# Altium schematic sheet Xbee.SchDoc
size A; SheetNumber: 3; SheetTotal: 3
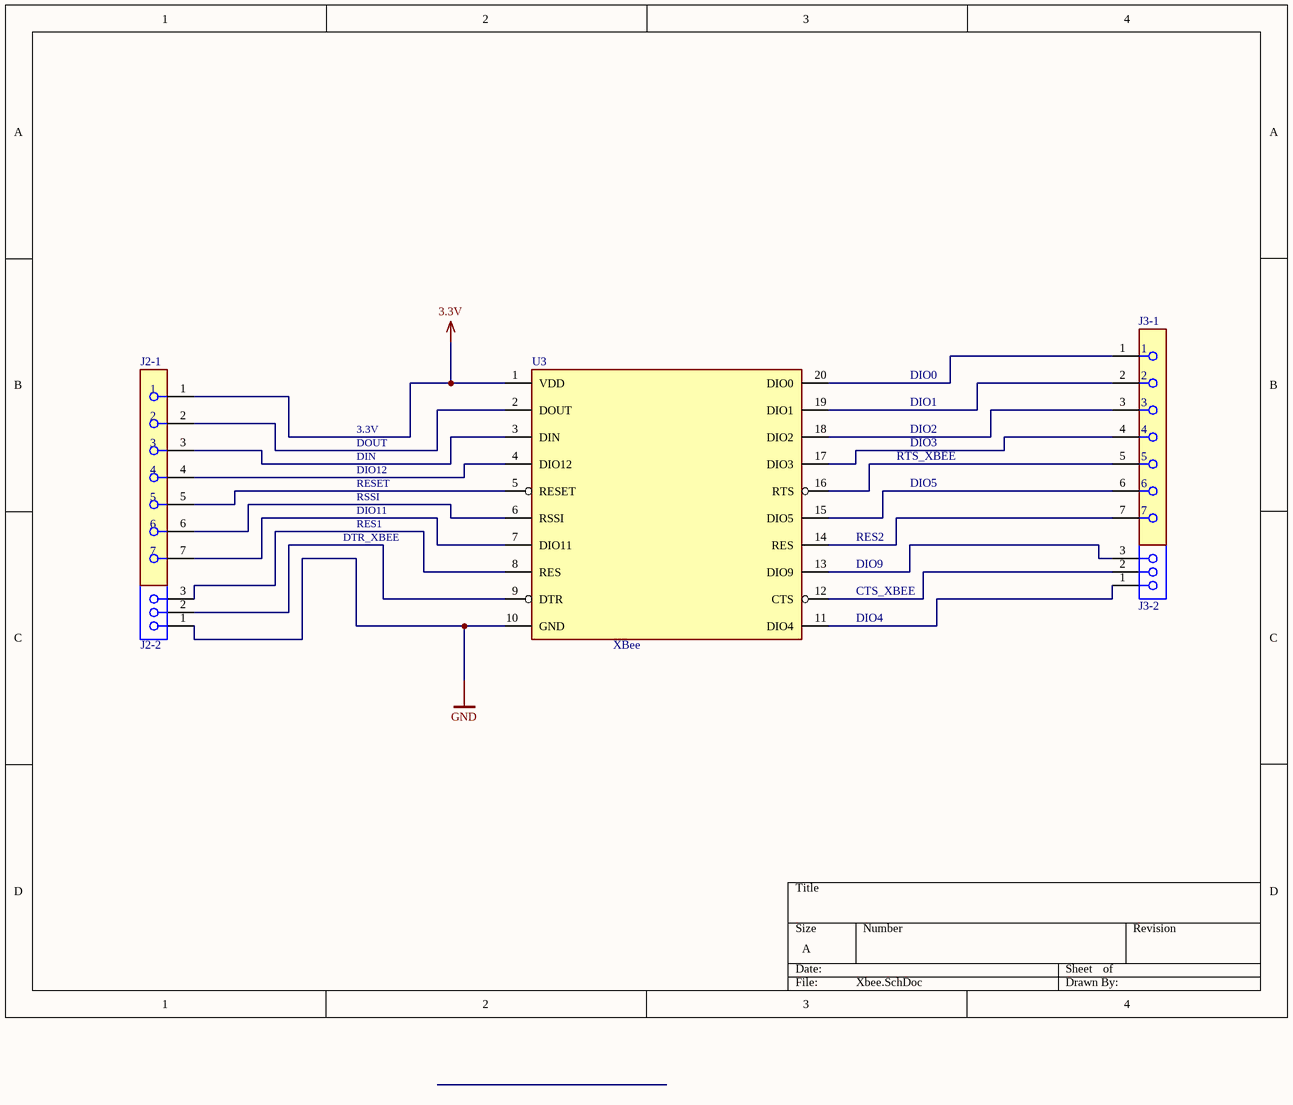
[diagram p0: Xbee.SchDoc]

## Parts
J2-1  SSM-107-L-SV-BE  [FP-SSM-107-L-SV-BE-MFG]  (value not drawn)
J2-2  SSM-103-L-SV  [SMTC-SSM-103-X-SV]  (value not drawn)
J3-1  SSM-107-L-SV-BE  [FP-SSM-107-L-SV-BE-MFG]  (value not drawn)
J3-2  SSM-103-L-SV  [SMTC-SSM-103-X-SV]  (value not drawn)
U3  XBee  [FP-XBP9B-DMUTB002-MFG]

## Nets
3.3V: J2-1.1 U3.1(VDD)
GND: J2-2.1 U3.10(GND)
NetJ2-1_2: J2-1.2 U3.2(DOUT)
NetJ2-1_3: J2-1.3 U3.3(DIN)
NetJ2-1_4: J2-1.4 U3.4(DIO12)
NetJ2-1_5: J2-1.5 U3.5(RESET)
NetJ2-1_6: J2-1.6 U3.6(RSSI)
NetJ2-1_7: J2-1.7 U3.7(DIO11)
NetJ2-2_2: J2-2.2 U3.9(DTR)
NetJ2-2_3: J2-2.3 U3.8(RES)
NetJ3-1_1: J3-1.1 U3.20(DIO0)
NetJ3-1_2: J3-1.2 U3.19(DIO1)
NetJ3-1_3: J3-1.3 U3.18(DIO2)
NetJ3-1_4: J3-1.4 U3.17(DIO3)
NetJ3-1_5: J3-1.5 U3.16(RTS)
NetJ3-1_6: J3-1.6 U3.15(DIO5)
NetJ3-1_7: J3-1.7 U3.14(RES)
NetJ3-2_1: J3-2.1 U3.11(DIO4)
NetJ3-2_2: J3-2.2 U3.12(CTS)
NetJ3-2_3: J3-2.3 U3.13(DIO9)

## Notes on the sheet
- 3.3V
- DIO0
- DIO1
- DIO2
- DOUT
- DIN
- DIO12
- RESET
- RSSI
- RTS_XBEE
- DIO3
- DIO5
- DTR_XBEE
- DIO11
- RES1
- RES2
- DIO9
- CTS_XBEE
- DIO4

## Library data of the parts
J2-1 J3-1 = CMP-02766-001731-1: CONN RCPT 7POS 0.1 GOLD SMD; Connector Type: Receptacle; Max Current Rating: 6.9A; Number of Positions: 7; Pitch: 2.54mm; Voltage Rating (AC): 405V; Voltage Rating (DC): 572V; Max Voltage Rating (AC): 475V; Contact Resistance: 10mR; Gender: Female; Series: SSM; Max Operating Temperature: 125°C; Number of Rows: 1; Contact Finish - Mating: GOLD; Radiation Hardening: No; Housing Color: Black; Orientation: Straight; Min Operating Temperature: -55°C; Length: 17.78mm; RoHS Compliant: Yes; Termination: Solder; Housing Material: Polymer; Insulation Color: Black; Number of Contacts: 7; Contact Shape: Square; Contact Plating: Gold; Insulation Material: Polymer; Depth: 2.54mm; Contact Material: Bronze; Packaging: Rail/Tube; Contact Type: Female Socket; Lead Free: Lead Free; Fastening Type: Pull
J2-2 J3-2 = CMP-1023-00201-1: Tiger Claw(TM) Surface Mount Socket, Vertical, -55 to 125 degC, 2.54 mm Pitch, 3-Pin, Female, RoHS; Manufacturer: Samtec; Pitch: 2.54 mm; Orientation: Vertical; Temperature Range: -55 to 125 degC; ComponentLink2URL: http://www.samtec.com/documents/webfiles/pdf/SSM_SM.PDF; DatasheetVersion: F-214; PackageDescription: .100 C.L. Surface Mount Socket Strip; PackageVersion: CR, 9/1998; ComponentLink1Description: Manufacturer URL; PackageReference: SSM-103-X-SV; ComponentLink3URL: http://www.samtec.com/documents/webfiles/cpdf/SSM-1XX-XXX-XX-XX-XX-X-XX-XX-MKT.pdf; RoHS: True; ComponentLink2Description: Datasheet; ComponentLink1URL: http://www.samtec.com; Mounting Technology: Surface Mount; ComponentLink3Description: Package Specification; PartNumber: SSM-103-L-SV
U3 = CMP-84319-000004-1: RX TXRX MOD ISM < 1GHZ U.FL TH; Max Supply Voltage: 3.6V; Current - Transmitting: 215mA; Sensitivity: -101dBm; Min Frequency: 902MHz; Memory Size: 2KB; Max Frequency: 928MHz; Min Supply Voltage: 2.4V; Current - Receiving: 29mA; Interface: SPI; Data Rate: 200Kbps; Frequency: 900MHz; Output Power (dBm): 24dBm; Number of Pins: 20; Series: XBee-Pro™; Max Operating Temperature: 85°C; Radiation Hardening: No; Min Operating Temperature: -40°C; Package Quantity: 1; RAM Size: 2KB; Packaging: Bulk; Case/Package: Module